# EAGLE design fonte (EAGLE 9.6.2)
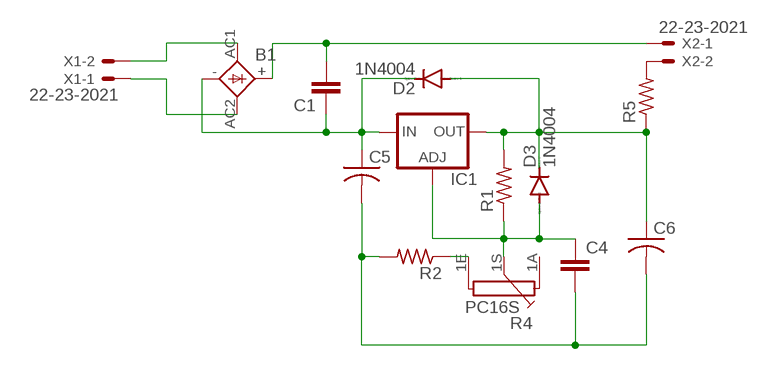
[diagram p0: schematic, sheet 1]

## Parts
B1  2KBB-R  [2KBB-R]
C1  C2,5-3  [C2.5-3]
C4  C2.5/2  [C2.5-2]
C5  C-US025-024X044  [C025-024X044]
C6  C-US025-024X044  [C025-024X044]
D2  1N4004  [DO41-10]
D3  1N4004  [DO41-10]
IC1  LM317L  [317L]
R1  R-US_0204/7  [0204/7]
R2  R-US_0204/7  [0204/7]
R4  PC16S  [PC16S]
R5  R-US_0204/7  [0204/7]
X1  22-23-2021  [22-23-2021]
X2  22-23-2021  [22-23-2021]

## Nets
N$1: B1.AC2 X1.1
N$2: B1.AC1 X1.2
N$3: B1.+ C1.2 X2.1
N$4: B1.- C1.1 C5.1 D2.C IC1.3(IN)
N$5: C4.2 C5.2 C6.2 R2.2
N$6: C6.1 D2.A D3.C IC1.2(OUT) R1.2 R5.1
N$7: C4.1 D3.A IC1.1(ADJ) R1.1 R4.1S
N$8: R2.1 R4.1E
N$10: R5.2 X2.2
Unconnected: R4.1A

## Library data of the parts
B1 = rectifier:2KBB-R: RECTIFIER grid 3 x 5 mm
C1 C4 = capacitor-wima:C: CAPACITOR naming: grid - package width
C5 C6 = rcl:C-US: CAPACITOR, American symbol; SPICEPREFIX: C
D2 D3 = diode:1N4004: DIODE general purpose rectifier, 1 A
IC1 = v-reg:LM317L: VOLTAGE REGULATOR
R1 R2 R5 = rcl:R-US_: RESISTOR, American symbol; SPICEPREFIX: R
R4 = piher:PC16S: POTENTIOMETER single carbon potentiometer, 16 mm, S3ROH; OC_FARNELL: 4452940; OC_NEWARK: unknown
X1 X2 = con-molex:22-23-2021: .100" (2.54mm) Center Header - 2 Pin; MF: MOLEX; MPN: 22-23-2021; OC_FARNELL: 1462926; OC_NEWARK: 25C3832

## Board
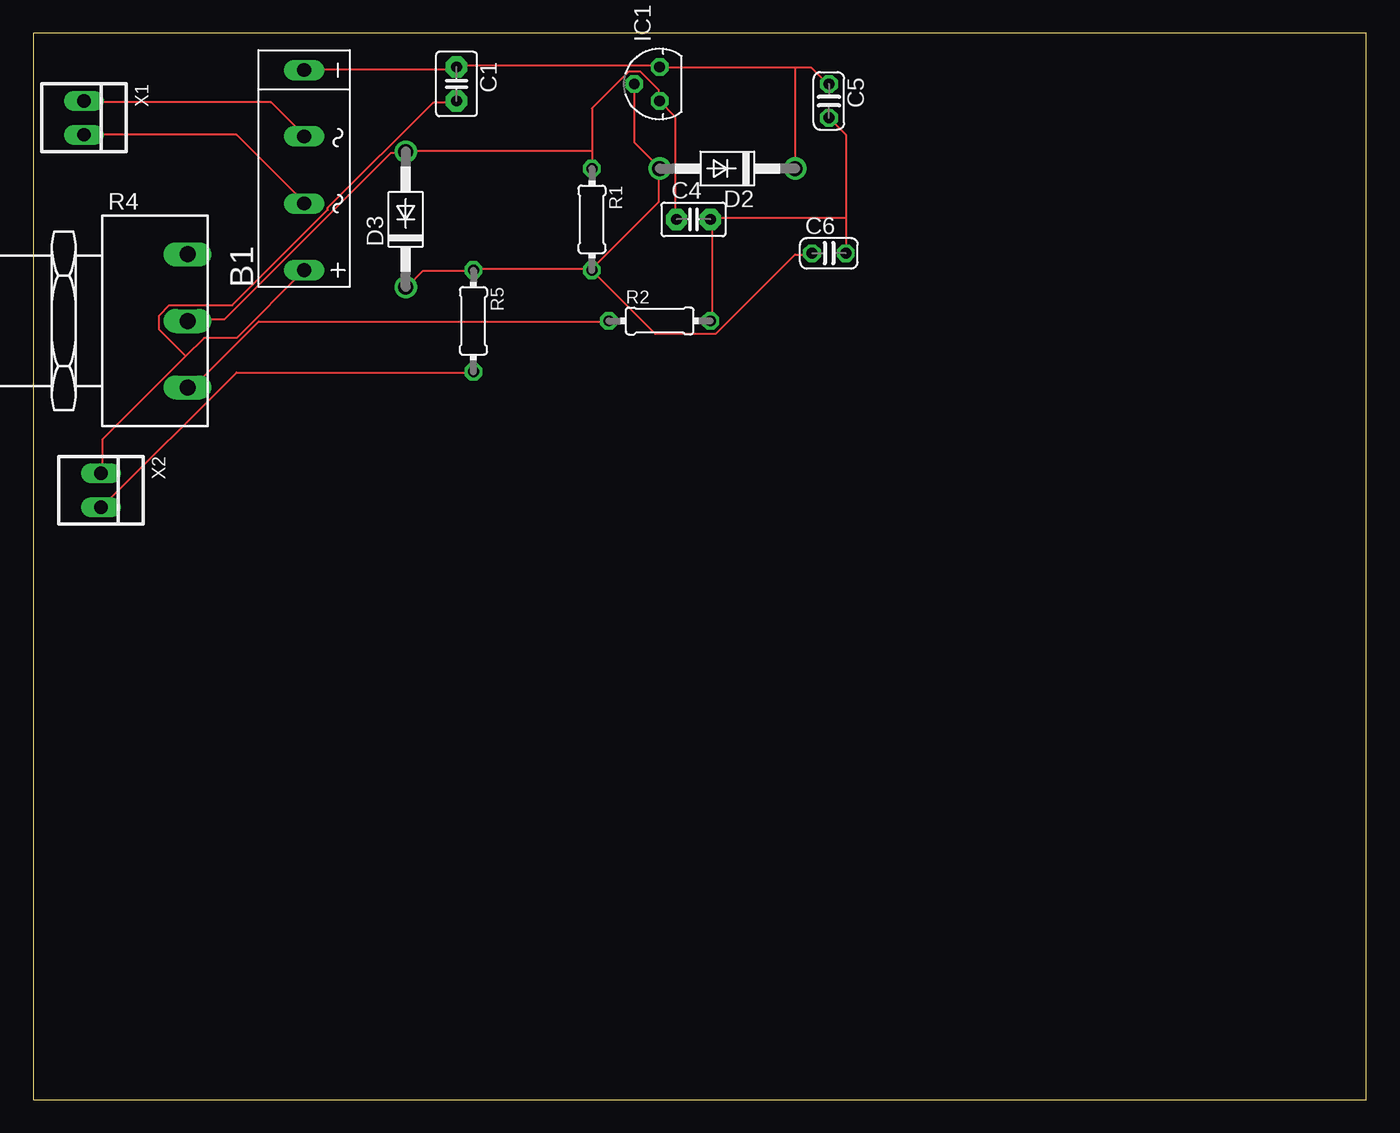
[diagram p1: board, top side]

Size 100 x 80 mm. Coordinates in mm from the lower left corner, seen from the top.
Outline: 0,0 100,0 100,80 0,80 0,0
Copper layers (1*16): Top 0.035mm / dielectric 1.5mm / Bottom 0.035mm
Design rules "default": minimum track width 6mil, minimum drill 0.35mm, track to track 6mil, track to pad 6mil, pad to pad 6mil, via to via 6mil, smd to smd 6mil, copper to edge 40mil, drill to drill 6mil, minimum pad ring 10mil, minimum via ring 8mil, stop-mask expansion 4mil, vias tented up to drill 0mil, thermal gap 10mil

### Footprints (pad centres in the part's own frame; a part is rotated, then mirrored left to right if it is on the bottom)
2KBB-R = drill 1.016 long: + -7.62,0; - 7.391,0; AC1 -2.616,0; AC2 2.413,0
C2.5-3 = drill 0.813 pad 1.6 octagon: 1 -1.27,0; 2 1.27,0
C2.5-2 = drill 0.813 pad 1.6 octagon: 1 -1.27,0; 2 1.27,0
C025-024X044 = drill 0.813 octagon: 1 -1.27,0; 2 1.27,0
DO41-10 = drill 1.118: A 5.08,0; C -5.08,0
317L = drill 0.813 octagon: 1 -1.27,0; 2 0,1.905; 3 1.27,0
0204/7 = drill 0.813 octagon: 1 -3.81,0; 2 3.81,0
PC16S = drill 1.2 long: 1A -5,6.5; 1E 5,6.5; 1S 0,6.5
22-23-2021 = drill 1 long: 1 -1.27,0; 2 1.27,0

### Placement (x,y rotation side)
B1  20.32,69.85 90 top
C1  31.75,76.2 270 top
C4  49.53,66.04 0 top
C5  59.69,74.93 270 top
C6  59.69,63.5 0 top
D2  52.07,69.85 180 top
D3  27.94,66.04 90 top
IC1  46.99,76.2 90 top
R1  41.91,66.04 270 top
R2  46.99,58.42 0 top
R4  5.08,58.42 270 top
R5  33.02,58.42 270 top
X1  3.81,73.66 270 top
X2  5.08,45.72 270 top

### Tracks (layer width: path | path; a pad name or v marks a point on that pad's centre or on a via)
N$1
  Top 0.152: X1.1 3.81,74.83 17.83,74.83 20.27,72.39 B1.AC2
N$2
  Top 0.152: X1.2 15.24,72.39 20.27,67.36 B1.AC1
N$3
  Top 0.152: 11.43,55.78 12.8,57.15 15.24,57.15 B1.+ | 11.43,55.78 5.18,49.53 5.18,47.09 X2.1 | 11.43,55.78 9.45,57.76 9.45,58.83 10.21,59.59 14.94,59.59 22.1,66.75 22.1,66.9 30.02,74.83 31.7,74.83 C1.2
N$4
  Top 0.152: B1.- 20.42,77.27 31.55,77.27 C1.1 31.85,77.57 46.94,77.57 IC1.3 47.09,77.42 57.15,77.42 | 57.15,77.42 58.37,77.42 59.59,76.2 C5.1 | 57.15,77.42 D2.C
N$5
  Top 0.152: R2.2 50.9,58.52 50.9,65.99 C4.2 50.9,66.14 60.96,66.14 | 60.96,66.14 60.96,72.39 C5.2 | 60.96,66.14 C6.2
N$6
  Top 0.152: IC1.2 45.11,76.2 45.11,71.78 46.94,69.95 D2.A 46.94,69.8 46.94,67.36 41.91,62.33 | D3.C 28.04,60.96 29.26,62.18 32.92,62.18 R5.1 33.07,62.33 41.91,62.33 | C6.1 58.37,63.4 57.15,63.4 51.21,57.45 46.63,57.45 41.91,62.18 R1.2 41.91,62.33
N$7
  Top 0.152: 41.91,71.17 41.91,74.37 44.65,77.11 45.57,77.11 46.94,75.74 46.94,74.98 IC1.1 48.16,73.76 48.16,66.14 C4.1 | 41.91,71.17 R1.1 | 41.91,71.17 28.04,71.17 D3.A 27.89,71.02 26.82,71.02 14.33,58.52 11.58,58.52 R4.1S
N$8
  Top 0.152: R2.1 43.13,58.37 16.92,58.37 12.04,53.49 11.58,53.49 R4.1E
N$10
  Top 0.152: R5.2 32.92,54.56 15.24,54.56 5.18,44.5 X2.2